# Altium schematic sheet MaestroDimmer.SchDoc
size Tabloid
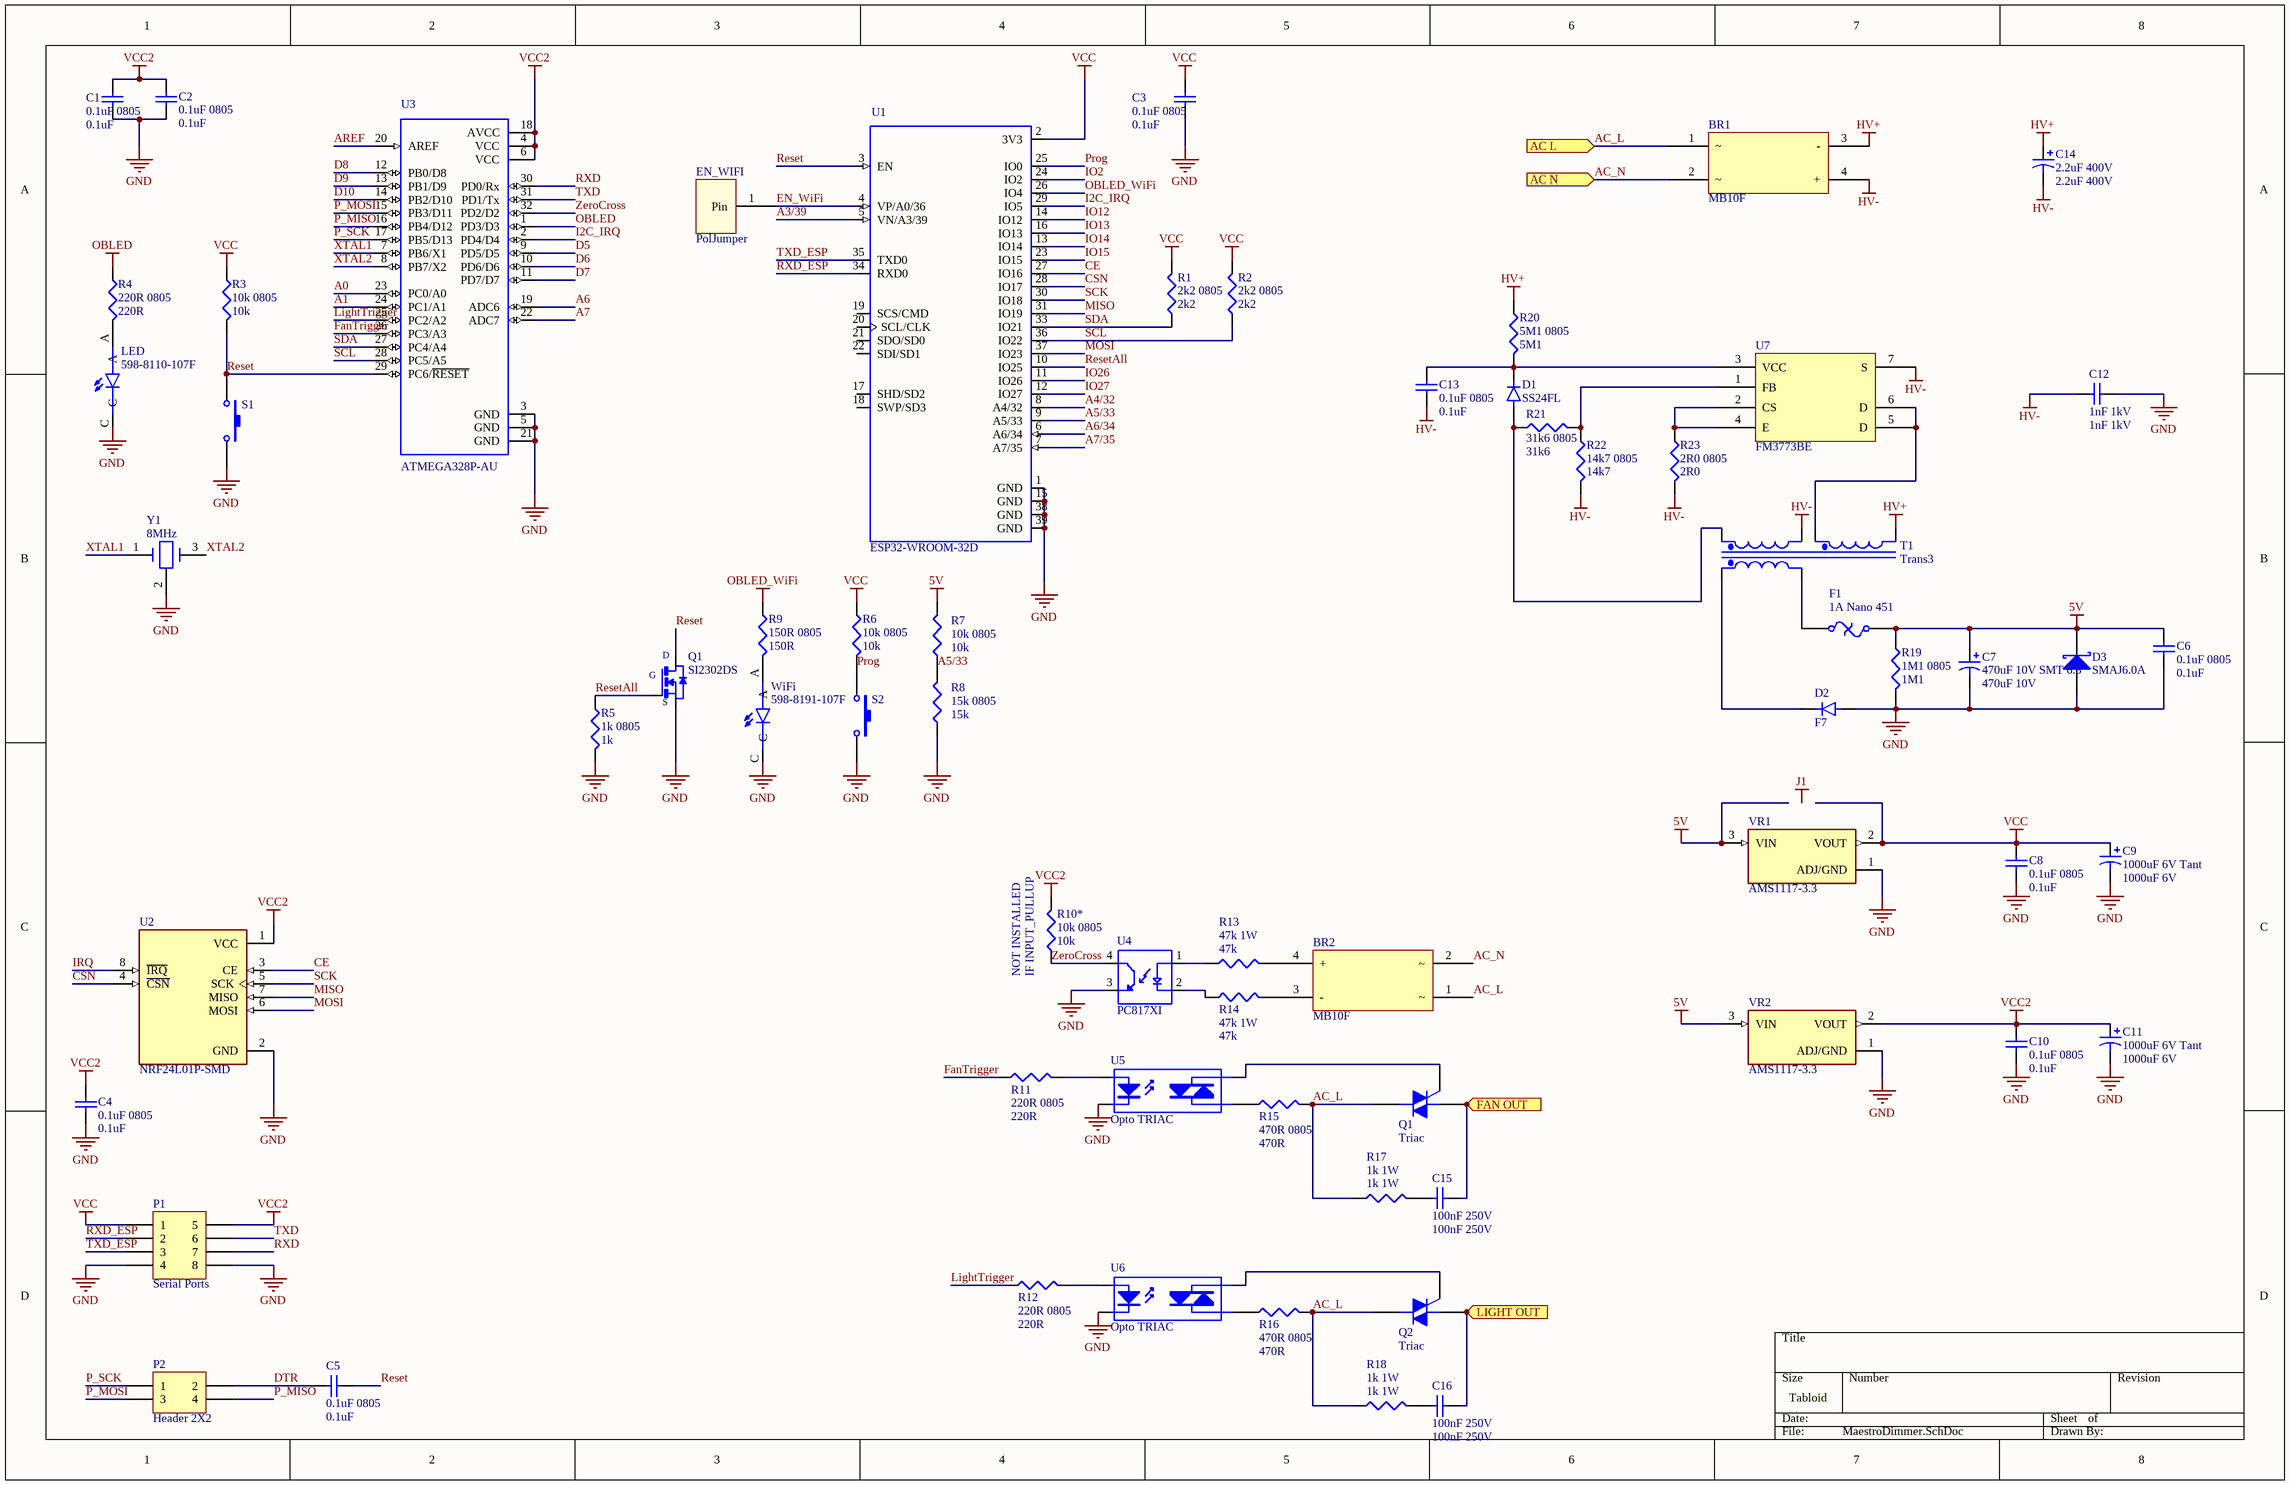
[diagram p0: MaestroDimmer.SchDoc]

## Parts
(Parts that share a designator on the sheet are numbered #1, #2 ... from top to bottom, then left to right.)
BR1  MB10F  [mb10f]
BR2  MB10F  [mb10f]
C1  0.1uF 0805  value 0.1uF  [C0805_3D]
C2  0.1uF 0805  value 0.1uF  [C0805_3D]
C3  0.1uF 0805  value 0.1uF  [C0805_3D]
C4  0.1uF 0805  value 0.1uF  [C0805_3D]
C5  0.1uF 0805  value 0.1uF  [C0805_3D]
C6  0.1uF 0805  value 0.1uF  [C0805_3D]
C7  470uF 10V SMT 6.3  value 470uF 10V  [CAP_SMT_6.3mm]
C8  0.1uF 0805  value 0.1uF  [C0805_3D]
C9  1000uF 6V Tant  value 1000uF 6V  [7343_Tantalum]
C10  0.1uF 0805  value 0.1uF  [C0805_3D]
C11  1000uF 6V Tant  value 1000uF 6V  [7343_Tantalum]
C12  1nF 1kV  [CAP_SMT_4MM_YL]
C13  0.1uF 0805  value 0.1uF  [C0805_3D]
C14  2.2uF 400V  [CAP_SMT_8mm]
C15  100nF 250V  [Radial_15mm_Ceramic]
C16  100nF 250V  [Radial_15mm_Ceramic]
D1  SS24FL  [DO215AD]
D2  F7  [DO214AC]
D3  SMAJ6.0A  [DO214AC]
EN_WIFI  PolJumper  [PolarityJumper]
F1  1A Nano 451  [451 fuse]
LED  598-8110-107F  [LEDC2012X70N]
P1  Serial Ports  [HDR2X4_CEN]
P2  Header 2X2  [HDR2X2]
Q1#1  SI2302DS  [SOT23]
Q1#2  Triac  [TO-220-Bent]
Q2  Triac  [TO-220-Bent]
R1  2k2 0805  value 2k2  [R0805_3D]
R2  2k2 0805  value 2k2  [R0805_3D]
R3  10k 0805  value 10k  [R0805_3D]
R4  220R 0805  value 220R  [R0805_3D]
R5  1k 0805  value 1k  [R0805_3D]
R6  10k 0805  value 10k  [R0805_3D]
R7  10k 0805  value 10k  [R0805_3D]
R8  15k 0805  value 15k  [R0805_3D]
R9  150R 0805  value 150R  [R0805_3D]
R10*  10k 0805  value 10k  [R0805_3D]
R11  220R 0805  value 220R  [R0805_3D]
R12  220R 0805  value 220R  [R0805_3D]
R13  47k 1W  value 47k  [2512 1W resistor]
R14  47k 1W  value 47k  [2512 1W resistor]
R15  470R 0805  value 470R  [R0805_3D]
R16  470R 0805  value 470R  [R0805_3D]
R17  1k 1W  [2512 1W resistor]
R18  1k 1W  [2512 1W resistor]
R19  1M1 0805  value 1M1  [R0805_3D]
R20  5M1 0805  value 5M1  [R0805_3D]
R21  31k6 0805  value 31k6  [R0805_3D]
R22  14k7 0805  value 14k7  [R0805_3D]
R23  2R0 0805  value 2R0  [R0805_3D]
S1  SW-PB  [PB_SW_SMT2]  (value not drawn)
S2  SW-PB  [PB_SW_SMT2]  (value not drawn)
T1  Trans3  [transfosmps]
U1  ESP32-WROOM-32D  [*MODULE_ESP32-WROOM-32D]
U2  NRF24L01P-SMD  [NRF24L01P-SMD]
U3  ATMEGA328P-AU  [*QFP80P900X900X120-32N]
U4  PC817XI  [SOP4_PC817]
U5  Opto TRIAC  [SOP6_MOC3021]
U6  Opto TRIAC  [SOP6_MOC3021]
U7  FM3773BE  [sop7]
VR1  AMS1117-3.3  [SOT-223]
VR2  AMS1117-3.3  [SOT-223]
WiFi  598-8191-107F  [LEDC2012X70N]
Y1  8MHz  [XTAL_SMT_3213]

## Ports
AC L, AC N, FAN OUT, LIGHT OUT

## Nets
5V: C6.2 C7.1 D3.2(K) F1.2 R7.2 R19.1 VR1.3(VIN) VR2.3(VIN)
GND: C1.1 C2.1 C3.1 C4.1 C6.1 C7.2 C8.1 C9.2 C10.1 C11.2 C12.2 D2.A D3.1(A) EN_WIFI.3(Gnd) LED.C P1.4 P1.8 Q1#1.2(S) R5.2 R8.1 R19.2 S1.2 S2.2 U1.1(GND) U1.15(GND) U1.38(GND) U1.39(GND) U2.2(GND) U3.3(GND) U3.5(GND) U3.21(GND) U4.3(ET) U5.2(K) U6.2(K) VR1.1(ADJ/GND) VR2.1(ADJ/GND) WiFi.C Y1.2(GND)
HV+: BR1.3(-) C14.1 R20.1 T1.6(Sec2-)
HV-: BR1.4(+) C12.1 C13.2 C14.2 R22.2 R23.2 T1.4(Sec1-) U7.7(S)
OBLED: R4.1 U3.1(PD3/D3)
OBLED_WiFi: R9.1 U1.26(IO4)
VCC: C3.2 C8.2 C9.1 EN_WIFI.2(Vcc) P1.1 R1.2 R2.2 R3.1 R6.1 U1.2(3V3) VR1.2(VOUT) VR1.4(VOUT)
VCC2: C1.2 C2.2 C4.2 C10.2 C11.1 P1.5 R10*.2 U2.1(VCC) U3.4(VCC) U3.6(VCC) U3.18(AVCC) VR2.2(VOUT) VR2.4(VOUT)
A0: U3.23(PC0/A0)
A1: U3.24(PC1/A1)
A3/39: U1.5(VN/A3/39)
A4/32: U1.8(A4/32)
A5/33: R7.1 R8.2 U1.9(A5/33)
A6: U3.19(ADC6)
A6/34: U1.6(A6/34)
A7: U3.22(ADC7)
A7/35: U1.7(A7/35)
AC_L: BR1.1 BR2.1 Q1#2.2(M2) Q2.2(M2) R15.2 R16.2 R17.1 R18.1 ; port AC L
AC_N: BR1.2 BR2.2 ; port AC N
AREF: U3.20(AREF)
CE: U1.27(IO16) U2.3(CE)
CSN: U1.28(IO17) U2.4(~{CSN})
D5: U3.9(PD5/D5)
D6: U3.10(PD6/D6)
D7: U3.11(PD7/D7)
D8: U3.12(PB0/D8)
D9: U3.13(PB1/D9)
D10: U3.14(PB2/D10)
DTR: C5.1 P2.2
EN_WiFi: EN_WIFI.1(Pin) U1.4(VP/A0/36)
FAN OUT: C15.2 Q1#2.1(M1) ; port FAN OUT
FanTrigger: R11.1 U3.26(PC3/A3)
I2C_IRQ: U1.29(IO5) U3.2(PD4/D4)
IO2: U1.24(IO2)
IO12: U1.14(IO12)
IO13: U1.16(IO13)
IO14: U1.13(IO14)
IO15: U1.23(IO15)
IO26: U1.11(IO26)
IO27: U1.12(IO27)
IRQ: U2.8(~{IRQ})
LIGHT OUT: C16.2 Q2.1(M1) ; port LIGHT OUT
LightTrigger: R12.1 U3.25(PC2/A2)
MISO: U1.31(IO19) U2.7(MISO)
MOSI: U1.37(IO23) U2.6(MOSI)
P_MISO: P2.4 U3.16(PB4/D12)
P_MOSI: P2.3 U3.15(PB3/D11)
P_SCK: P2.1 U3.17(PB5/D13)
Prog: R6.2 S2.1 U1.25(IO0)
Reset: C5.2 Q1#1.3(D) R3.2 S1.1 U1.3(EN) U3.29(PC6/~{RESET})
ResetAll: Q1#1.1(G) R5.1 U1.10(IO25)
RXD: P1.7 U3.30(PD0/Rx)
RXD_ESP: P1.2 U1.34(RXD0)
SCK: U1.30(IO18) U2.5(SCK)
SCL: R2.1 U1.36(IO22) U3.28(PC5/A5)
SDA: R1.1 U1.33(IO21) U3.27(PC4/A4)
TXD: P1.6 U3.31(PD1/Tx)
TXD_ESP: P1.3 U1.35(TXD0)
XTAL1: U3.7(PB6/X1) Y1.1(OSC1)
XTAL2: U3.8(PB7/X2) Y1.3(OSC2)
ZeroCross: R10*.1 U3.32(PD2/D2) U4.4(CT)
NetBR2_3: BR2.3(-) R14.2
NetBR2_4: BR2.4(+) R13.2
NetC13_1: C13.1 D1.C R20.2 U7.3(VCC)
NetC15_1: C15.1 R17.2
NetC16_1: C16.1 R18.2
NetD1_A: D1.A R21.1 T1.3(Sec1+)
NetD2_K: D2.K T1.1(Pri+)
NetF1_1: F1.1 T1.2(Pri-)
NetLED_A: LED.A R4.2
NetQ1#2_3: Q1#2.3(G) U5.4(A/K)
NetQ2_3: Q2.3(G) U6.4(A/K)
NetR9_2: R9.2 WiFi.A
NetR11_2: R11.2 U5.1(A)
NetR12_2: R12.2 U6.1(A)
NetR13_1: R13.1 U4.1(A)
NetR14_1: R14.1 U4.2(C)
NetR15_1: R15.1 U5.6(A/K)
NetR16_1: R16.1 U6.6(A/K)
NetR21_2: R21.2 R22.1 U7.1(FB)
NetR23_1: R23.1 U7.2(CS) U7.4(E)
NetT1_5: T1.5(Sec2+) U7.5(D) U7.6(D)

Not connected (* = marked no-connect by the designer): U1 17(SHD/SD2) 18(SWP/SD3) 19(SCS/CMD) 20(SCL/CLK) 21(SDO/SD0) 22(SDI/SD1)

## Notes on the sheet
- (near R10*) NOT INSTALLED
- (near R10*) IF INPUT_PULLUP
- Labels drawn without touching a wire or pin: J1

## Library data of the parts
C1-C6 C8 C10 C12 C13 C15 C16 = Cap: Capacitor; Published: 8-Jun-2000; LatestRevisionDate: 17-Jul-2002; LatestRevisionNote: Re-released for DXP Platform.; PackageReference: RAD-0.3; Publisher: Altium Limited; PackageDescription: Radial Cap, Thru-Hole; 2 Leads; 0.3 in Pin Spacing
  C12: Value: 1nF 1kV
  C15 C16: Value: 100nF 250V
C7 C9 C11 C14 = Cap Pol3: Polarized Capacitor (Surface Mount); Published: 8-Jun-2000; LatestRevisionDate: 29-May-2009; LatestRevisionNote: IPC-7351 Footprint Added.; PackageReference: C0805; Publisher: Altium Limited; PackageDescription: Chip Capacitor
  C14: Value: 2.2uF 400V
D1 D2 = SS24FL: Diode Schottky 40V 2A Surface Mount SOD-123F; MF: ON Semiconductor; Package: SOD-123F ON Semiconductor; MP: SS24FL; Value: *; Availability: Unavailable; Price: None; SnapEDA_Link: https://www.snapeda.com/parts/SS24FL/ON%20Semiconductor/view-part/1865502/?ref=snap
D3 = Diode 11DQ03: Schottky Rectifier; pin to pad: 1>A 2>K; Published: 8-Jun-2000; LatestRevisionDate: 17-Jul-2002; LatestRevisionNote: Re-released for DXP Platform.; DatasheetVersion: Dec-1997; PackageReference: DO-204AL; Publisher: Altium Limited; PackageDescription: Diode, Axial; Body 5.2 x 2.7 mm (LxDia. max), Lead Dia. 0.86 mm (max); Code_JEDEC: DO-204-AL; ComponentLink1Description: Manufacturer Link; ComponentLink1URL: http://www.irf.com/; ComponentLink2Description: Datasheet; ComponentLink2URL: http://www.irf.com/product-info/datasheets/data/11dq03.pdf
F1 = Fuse Thermal: 1A Nano 451 SMD 6.1x2.69mm; Published: 24-Mar-1999; LatestRevisionDate: 17-Jul-2002; LatestRevisionNote: Re-released for DXP Platform.; PackageReference: PIN-W2/E2.8; Publisher: Altium Limited; PackageDescription: Thru-Hole; 2 Leads
LED = 598-8191-107F: Red 635nm LED Indication - Discrete 2.2V 0805 _2012 Metric_; MF: Dialight; Package: 0805 Dialight; Value: *; Availability: Unavailable; MP: 598-8191-107F; SnapEDA_Link: https://www.snapeda.com/parts/598-8191-107F/Dialight/view-part/432480/?ref=snap; Price: None
P1 = Header 4X2A: Header, 4-Pin, Dual row; LatestRevisionDate: 17-Jul-2002; LatestRevisionNote: Re-released for DXP Platform.; Publisher: Altium Limited
P2 = Header 2X2: Header, 2-Pin, Dual row; LatestRevisionDate: 17-Jul-2002; LatestRevisionNote: Re-released for DXP Platform.; Publisher: Altium Limited
Q1#1 = SI2302DS: N-Channel 20V 2.5A _Tc_ 830mW _Tc_ Surface Mount TO-236AB _SOT23_; MF: NXP USA; Availability: Unavailable; Value: *; Price: None; SnapEDA_Link: https://www.snapeda.com/parts/SI2302DS/NXP%20USA%20Inc./view-part/767383/?ref=snap; MP: SI2302DS; Package: SOT-23-3 NXP USA
Q1#2 Q2 = Triac: Silicon Bidirectional Triode Thyristor; Note: Pin 2 is electrically connected to Pin 4 (TAB); Published: 29-Sep-2000; LatestRevisionDate: 17-Jul-2002; LatestRevisionNote: Re-released for DXP Platform.; DatasheetVersion: 1999; PackageReference: 369-03; Publisher: Altium Limited; PackageDescription: TO, Thru-Hole, Vertical, Heatsink Mounted; 3 In-Line Leads; Pitch 2.28 mm; ComponentLink1Description: Manufacturer Link; ComponentLink1URL: http://www.motorola.com/
R1-R9 R10* R11-R23 = Res3: Resistor; Published: 8-Jun-2000; LatestRevisionDate: 29-May-2009; LatestRevisionNote: IPC-7351 Footprint Added.; PackageReference: J1-0603; Publisher: Altium Limited; PackageDescription: Chip Resistor
  R17 R18: Value: 1k 1W
S1 S2 = SW-PB: Switch; Published: 24-Mar-1999; LatestRevisionDate: 17-Jul-2002; LatestRevisionNote: Re-released for DXP Platform.; PackageReference: SPST-2; Publisher: Altium Limited; PackageDescription: Switch; 2 Leads
T1 = Trans3: Three-winding Transformer (Non-Ideal); Sim Note: Enter the turns ratios, Core loss resistance, Magnetising Reactance, Leakage Reactances and Resistances referred to the primary side into the parameter fields.; Published: 25-Jan-2001; LatestRevisionDate: 17-Jul-2002; LatestRevisionNote: Re-released for DXP Platform.; PackageReference: TRF_6; Publisher: Altium Limited; PackageDescription: Transformer; 6 Leads
U1 = ESP32-WROOM-32D: IC: SoC; GPIO, I2C, I2S, IR, SD, SDIO, SPI, UART; 2.7÷3.6VDC; 20dBm; MF: Espressif Systems; SnapEDA_Link: https://www.snapeda.com/parts/ESP32-WROOM-32D/Espressif%20Systems/view-part/?ref=snap; Package: Module Espressif Systems; MP: ESP32-WROOM-32D; Availability: Unavailable; Price: None; Value: *
U2 = NRF24L01P-SMD: - Transceiver For Use With nRF24L01+; MP: NRF24L01P-MODULE-PCB; MF: Nordic Semiconductor; Package: None; Value: *; Availability: Bad; Price: None; SnapEDA_Link: https://www.snapeda.com/parts/NRF24L01P-MODULE-PCB/Nordic%20Semiconductor%20ASA/view-part/230534/?ref=snap; Mouser-Purchase-URL: https://snapeda.com/shop?store=Mouser&id=230534
U3 = ATMEGA328P-AU: AVR AVR® ATmega Microcontroller IC 8-Bit 20MHz 32KB _16K x 16_ FLASH 32-TQFP _7x7_; MF: Microchip; Package: TQFP-32 Microchip; Price: None; MP: ATMEGA328P-AU; Availability: Unavailable; SnapEDA_Link: https://www.snapeda.com/parts/ATMEGA328P-AU/Microchip/view-part/586529/?ref=snap; Value: *
U4 = PC817XI: Optoisolator Transistor Output 5000Vrms 1 Channel 4-SMD; MF: Sharp Microelectronics; Price: None; Package: SMD-4 Sharp; Value: *; MP: PC817XI; Availability: Unavailable; SnapEDA_Link: https://www.snapeda.com/parts/PC817XI/Sharp%20Microelectronics/view-part/494182/?ref=snap
U5 U6 = Opto TRIAC: Opto-Triac; Published: 24-Mar-1999; LatestRevisionDate: 17-Jul-2002; LatestRevisionNote: Re-released for DXP Platform.; PackageReference: NPSIP4A; Publisher: Altium Limited; PackageDescription: SIP; 4 Leads; Body 10 x 11.5 x 7.5 mm (typ); Pitch 2.54 mm
VR1 VR2 = AMS1117-3.3: Sot223/Pkg 1-Amp 3.3-Volt Low Drop Out Voltage Regulatator; MF: Advanced Monolithic Systems; Price: None; Package: None; Value: *; MP: AMS1117-3.3; Availability: Unavailable; SnapEDA_Link: https://www.snapeda.com/parts/AMS1117-3.3/Advanced%20Monolithic%20Systems/view-part/53450/?ref=snap
WiFi = 598-8191-107F: Blue 473nm LED Indication - Discrete 3.2V 0805 _2012 Metric_; MF: Dialight; Package: 0805 Dialight; Value: *; Availability: Unavailable; MP: 598-8191-107F; SnapEDA_Link: https://www.snapeda.com/parts/598-8191-107F/Dialight/view-part/432480/?ref=snap; Price: None
Y1 = XTAL: Crystal Oscillator; Published: 8-Jun-2000; LatestRevisionDate: 17-Jul-2002; LatestRevisionNote: Re-released for DXP Platform.; PackageReference: R38; Publisher: Altium Limited; PackageDescription: Crystal, Thru-Hole; 2 Leads; Body 3.1 x 8.2 mm (Dia.xH)